# Altium schematic sheet System Control - FPGA Supply and Configuration.SchDoc
size C
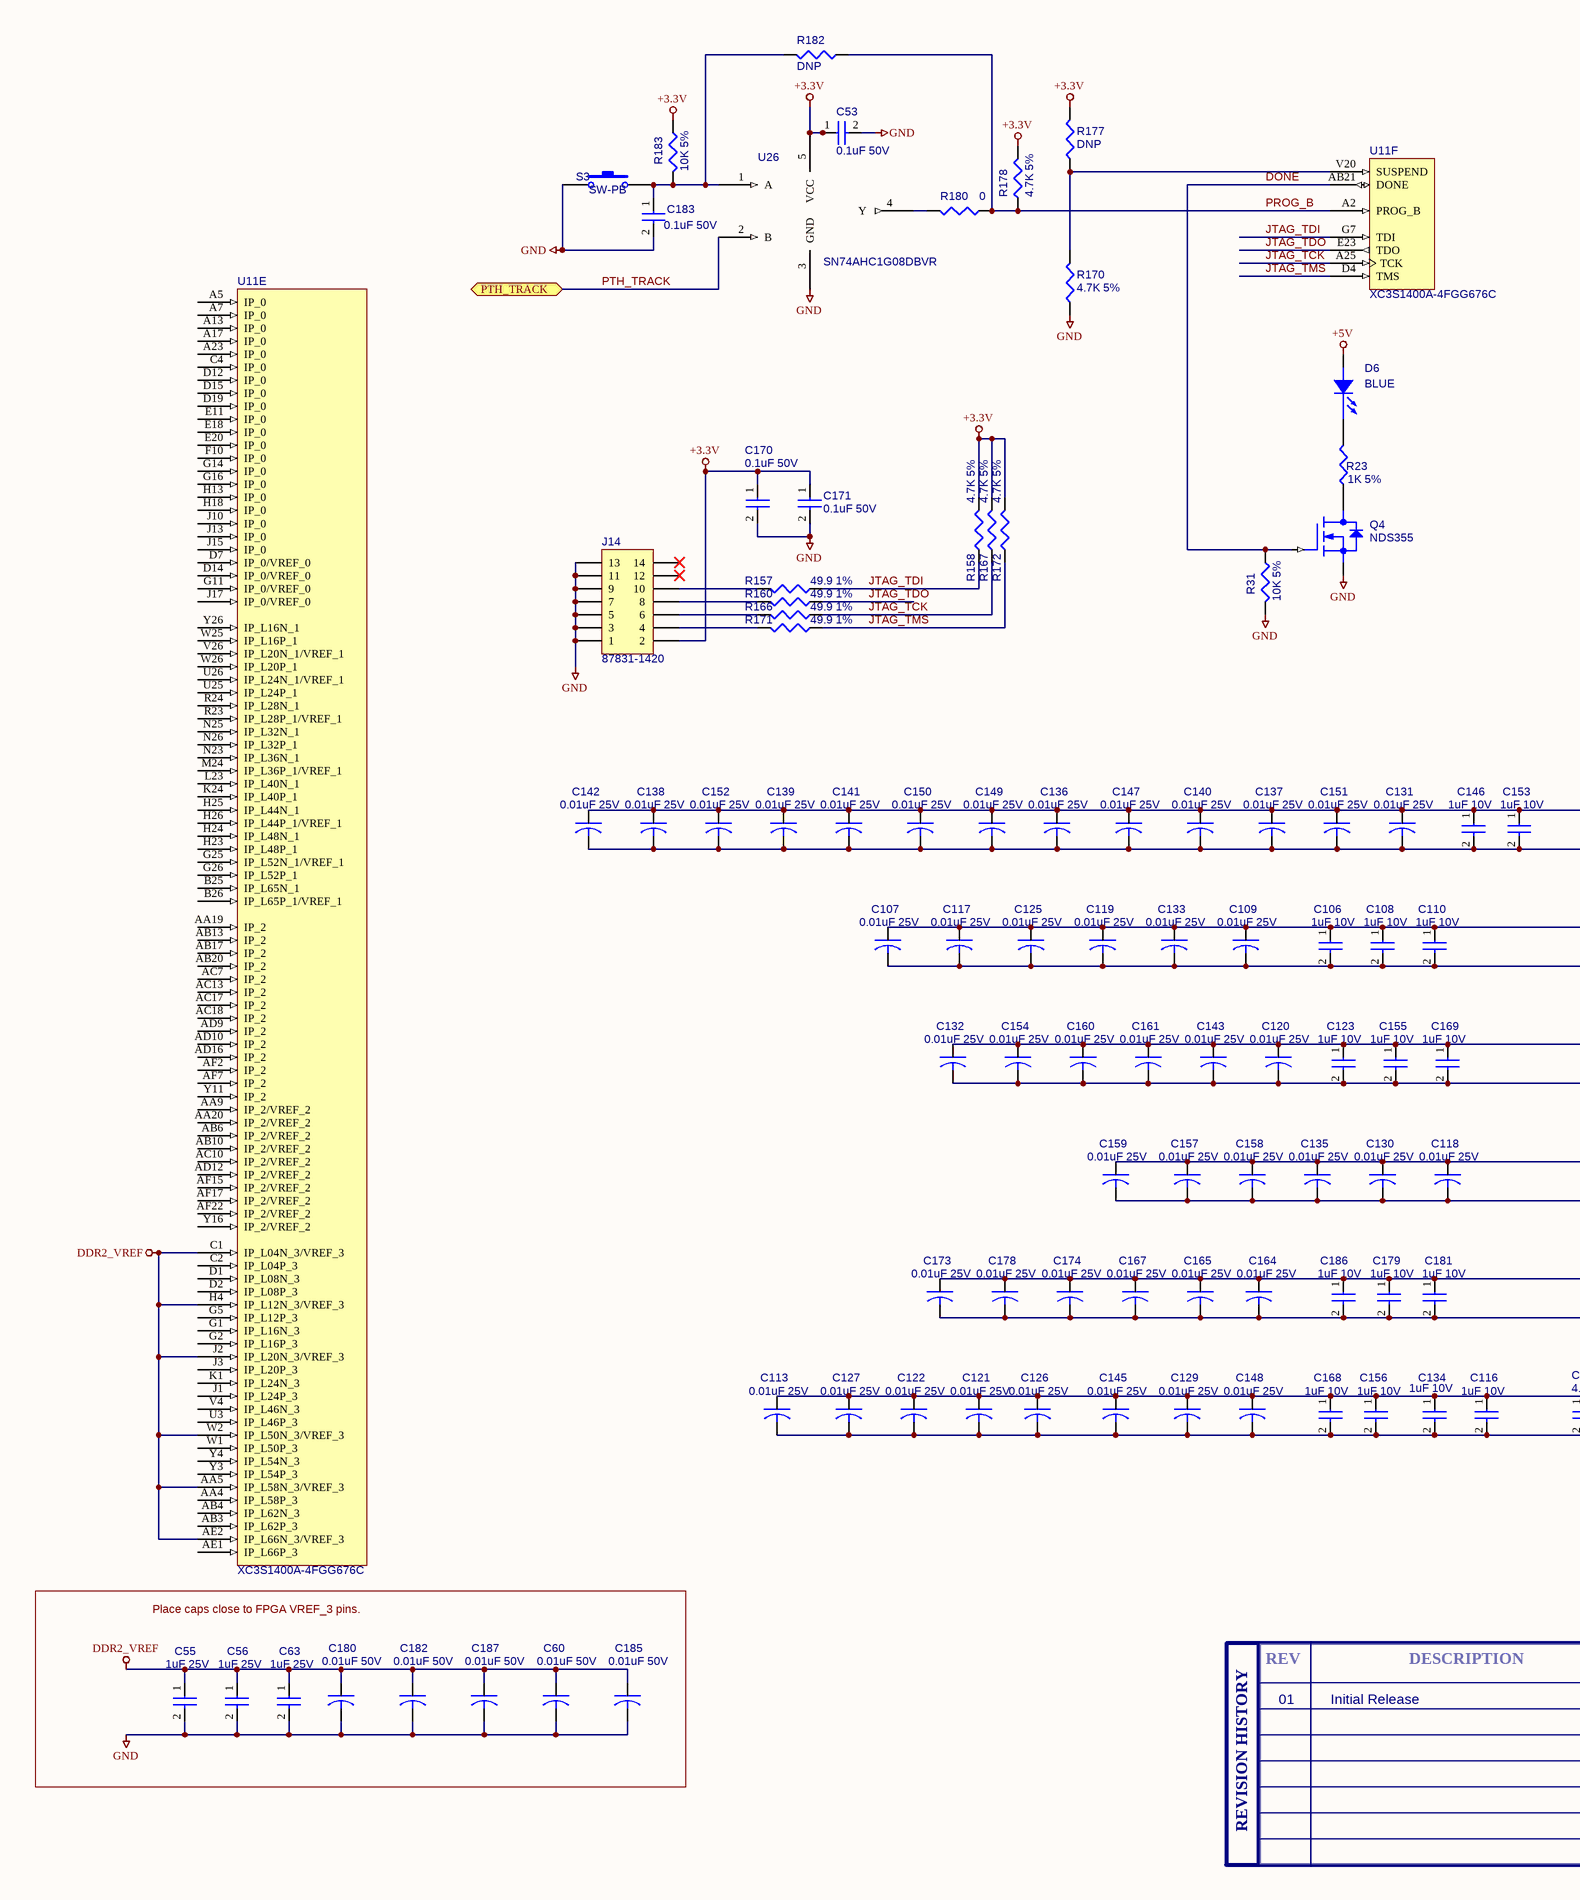
[diagram p0: System Control - FPGA Supply and Configuration.SchDoc, left]
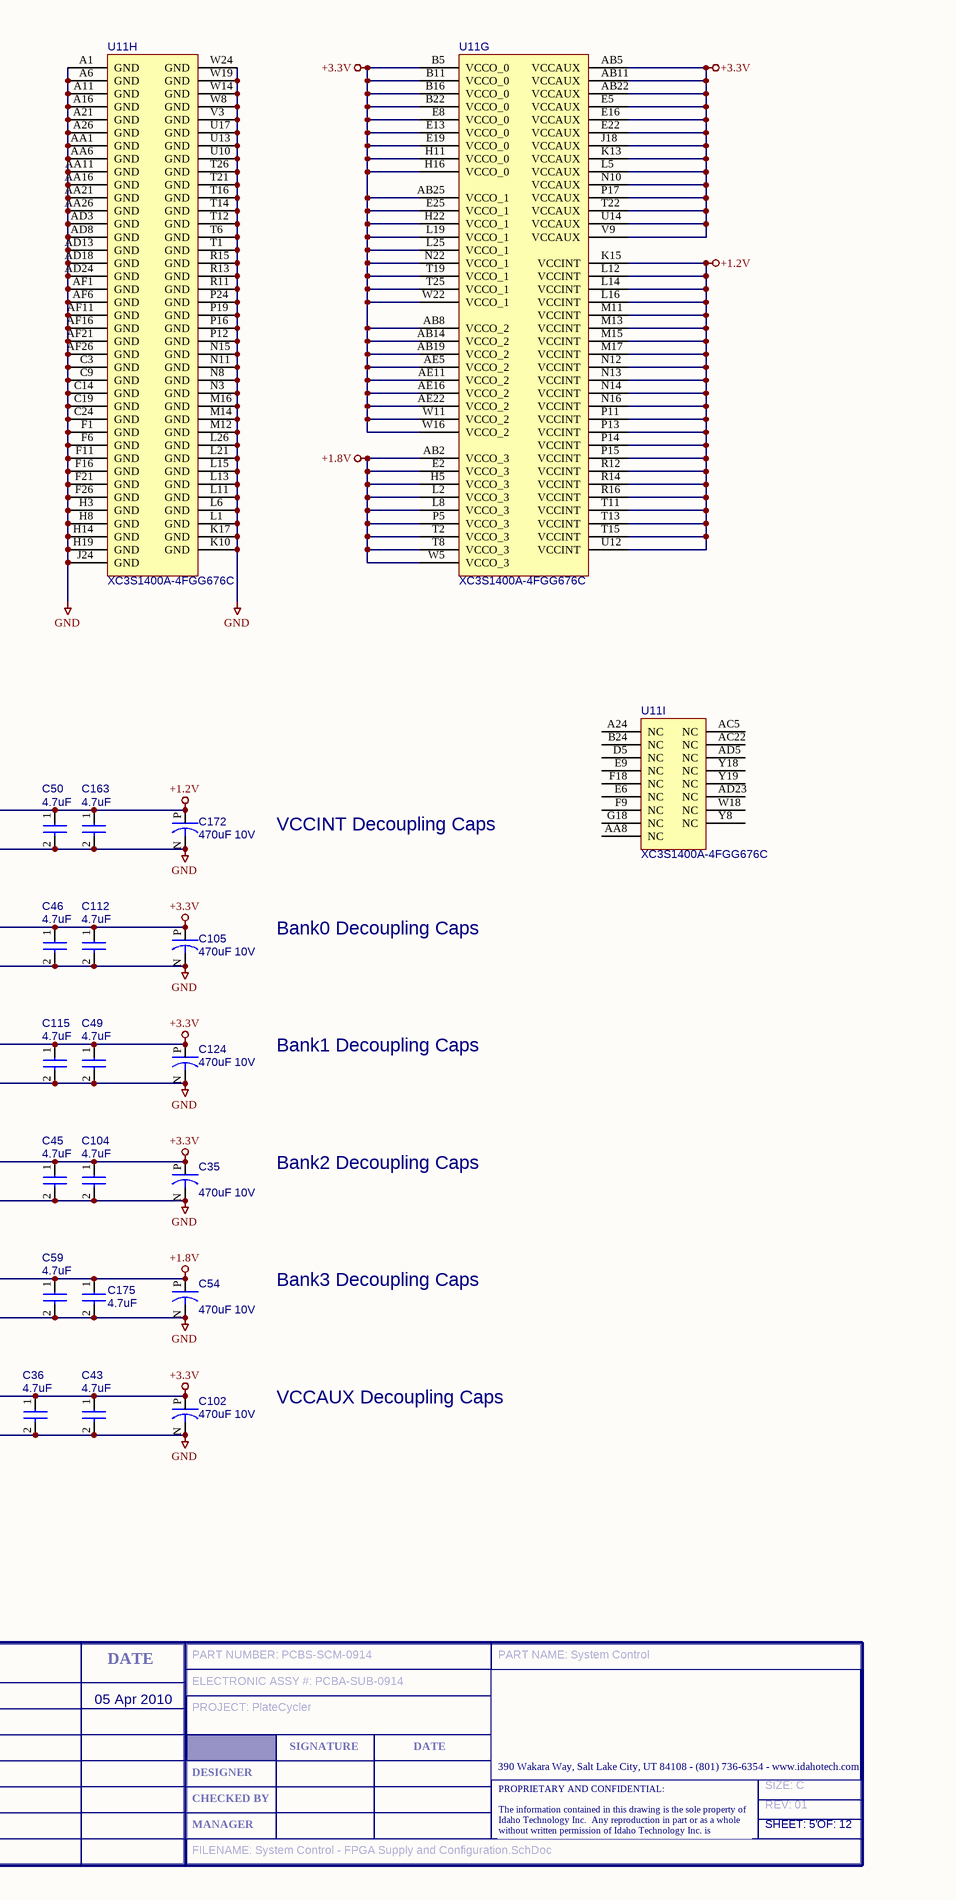
[diagram p1: System Control - FPGA Supply and Configuration.SchDoc, right]

## Parts
C35  470uF 10V  [SM/CT_7360]
C36  4.7uF  [SM/C_0603]
C43  4.7uF  [SM/C_0603]
C45  4.7uF  [SM/C_0603]
C46  4.7uF  [SM/C_0603]
C49  4.7uF  [SM/C_0603]
C50  4.7uF  [SM/C_0603]
C53  0.1uF 50V  [SM/C_0603]
C54  470uF 10V  [SM/CT_7360]
C55  1uF 25V  [SM/C_0603]
C56  1uF 25V  [SM/C_0603]
C59  4.7uF  [SM/C_0603]
C60  0.01uF 50V  [SM/C_0603]
C63  1uF 25V  [SM/C_0603]
C102  470uF 10V  [SM/CT_7360]
C104  4.7uF  [SM/C_0603]
C105  470uF 10V  [SM/CT_7360]
C106  1uF 10V  [SM/C_0603]
C107  0.01uF 25V  [SM/C_0402]
C108  1uF 10V  [SM/C_0603]
C109  0.01uF 25V  [SM/C_0402]
C110  1uF 10V  [SM/C_0603]
C112  4.7uF  [SM/C_0603]
C113  0.01uF 25V  [SM/C_0402]
C115  4.7uF  [SM/C_0603]
C116  1uF 10V  [SM/C_0603]
C117  0.01uF 25V  [SM/C_0402]
C118  0.01uF 25V  [SM/C_0402]
C119  0.01uF 25V  [SM/C_0402]
C120  0.01uF 25V  [SM/C_0402]
C121  0.01uF 25V  [SM/C_0402]
C122  0.01uF 25V  [SM/C_0402]
C123  1uF 10V  [SM/C_0603]
C124  470uF 10V  [SM/CT_7360]
C125  0.01uF 25V  [SM/C_0402]
C126  0.01uF 25V  [SM/C_0402]
C127  0.01uF 25V  [SM/C_0402]
C129  0.01uF 25V  [SM/C_0402]
C130  0.01uF 25V  [SM/C_0402]
C131  0.01uF 25V  [SM/C_0402]
C132  0.01uF 25V  [SM/C_0402]
C133  0.01uF 25V  [SM/C_0402]
C134  1uF 10V  [SM/C_0603]
C135  0.01uF 25V  [SM/C_0402]
C136  0.01uF 25V  [SM/C_0402]
C137  0.01uF 25V  [SM/C_0402]
C138  0.01uF 25V  [SM/C_0402]
C139  0.01uF 25V  [SM/C_0402]
C140  0.01uF 25V  [SM/C_0402]
C141  0.01uF 25V  [SM/C_0402]
C142  0.01uF 25V  [SM/C_0402]
C143  0.01uF 25V  [SM/C_0402]
C145  0.01uF 25V  [SM/C_0402]
C146  1uF 10V  [SM/C_0603]
C147  0.01uF 25V  [SM/C_0402]
C148  0.01uF 25V  [SM/C_0402]
C149  0.01uF 25V  [SM/C_0402]
C150  0.01uF 25V  [SM/C_0402]
C151  0.01uF 25V  [SM/C_0402]
C152  0.01uF 25V  [SM/C_0402]
C153  1uF 10V  [SM/C_0603]
C154  0.01uF 25V  [SM/C_0402]
C155  1uF 10V  [SM/C_0603]
C156  1uF 10V  [SM/C_0603]
C157  0.01uF 25V  [SM/C_0402]
C158  0.01uF 25V  [SM/C_0402]
C159  0.01uF 25V  [SM/C_0402]
C160  0.01uF 25V  [SM/C_0402]
C161  0.01uF 25V  [SM/C_0402]
C163  4.7uF  [SM/C_0603]
C164  0.01uF 25V  [SM/C_0402]
C165  0.01uF 25V  [SM/C_0402]
C167  0.01uF 25V  [SM/C_0402]
C168  1uF 10V  [SM/C_0603]
C169  1uF 10V  [SM/C_0603]
C170  0.1uF 50V  [SM/C_0603]
C171  0.1uF 50V  [SM/C_0603]
C172  470uF 10V  [SM/CT_7360]
C173  0.01uF 25V  [SM/C_0402]
C174  0.01uF 25V  [SM/C_0402]
C175  4.7uF  [SM/C_0603]
C178  0.01uF 25V  [SM/C_0402]
C179  1uF 10V  [SM/C_0603]
C180  0.01uF 50V  [SM/C_0603]
C181  1uF 10V  [SM/C_0603]
C182  0.01uF 50V  [SM/C_0603]
C183  0.1uF 50V  [SM/C_0603]
C185  0.01uF 50V  [SM/C_0603]
C186  1uF 10V  [SM/C_0603]
C187  0.01uF 50V  [SM/C_0603]
D6  BLUE  [LED 1206]
J14  Header 7X2  [87831-1420]  (value not drawn)
Q4  NDS355  [TO236AA/SOT23]
R23  1K 5%  [SM/R_0603]
R31  10K 5%  [SM/R_0603]
R157  49.9 1%  [SM/R_0603]
R158  4.7K 5%  [SM/R_0603]
R160  49.9 1%  [SM/R_0603]
R166  49.9 1%  [SM/R_0603]
R167  4.7K 5%  [SM/R_0603]
R170  4.7K 5%  [SM/R_0603]
R171  49.9 1%  [SM/R_0603]
R172  4.7K 5%  [SM/R_0603]
R177  DNP  [SM/R_0603]  (no BOM)
R178  4.7K 5%  [SM/R_0603]
R180  0  [SM/R_0603]
R182  DNP  [SM/R_0603]  (no BOM)
R183  10K 5%  [SM/R_0603]
S3  SW-PB  [PBSW SMD]
T?  SIZE: C  REV: 01  FILENAME: System Control - FPGA Supply and Configuration.SchDoc  PART NUMBER: PCBS-SCM-0914  PART NAME: System Control  ELECTRONIC ASSY #: PCBA-SUB-0914  PROJECT: PlateCycler  SHEET: 5'  OF: 12  (hidden comment: ITI Title Block, A Size)  (graphical)
U11  XC3S1400A-4FGG676C  [FGG676]  (parts E,F,G,H,I of 9)
U26  Manufacturer P/N: SN74AHC1G08DBVR  [SOT23-5]  (hidden comment: SN74AHC1G08)

## Blocks framed on the sheet
Place caps close to FPGA VREF_3 pins.: C55 C56 C60 C63 C180 C182 C185 C187

## Ports
PTH_TRACK

## Nets
+1.2V: C50.1 C131.1 C136.1 C137.1 C138.1 C139.1 C140.1 C141.1 C142.1 C146.1 C147.1 C149.1 C150.1 C151.1 C152.1 C153.1 C163.1 C172.P U11.K15(VCCINT) U11.L12(VCCINT) U11.L14(VCCINT) U11.L16(VCCINT) U11.M11(VCCINT) U11.M13(VCCINT) U11.M15(VCCINT) U11.M17(VCCINT) U11.N12(VCCINT) U11.N13(VCCINT) U11.N14(VCCINT) U11.N16(VCCINT) U11.P11(VCCINT) U11.P13(VCCINT) U11.P14(VCCINT) U11.P15(VCCINT) U11.R12(VCCINT) U11.R14(VCCINT) U11.R16(VCCINT) U11.T11(VCCINT) U11.T13(VCCINT) U11.T15(VCCINT) U11.U12(VCCINT)
+1.8V: C54.P C59.1 C164.1 C165.1 C167.1 C173.1 C174.1 C175.1 C178.1 C179.1 C181.1 C186.1 U11.AB2(VCCO_3) U11.E2(VCCO_3) U11.H5(VCCO_3) U11.L2(VCCO_3) U11.L8(VCCO_3) U11.P5(VCCO_3) U11.T2(VCCO_3) U11.T8(VCCO_3) U11.W5(VCCO_3)
+3.3V: C35.P C36.1 C43.1 C45.1 C46.1 C49.1 C53.1 C102.P C104.1 C105.P C106.1 C107.1 C108.1 C109.1 C110.1 C112.1 C113.1 C115.1 C116.1 C117.1 C118.1 C119.1 C120.1 C121.1 C122.1 C123.1 C124.P C125.1 C126.1 C127.1 C129.1 C130.1 C132.1 C133.1 C134.1 C135.1 C143.1 C145.1 C148.1 C154.1 C155.1 C156.1 C157.1 C158.1 C159.1 C160.1 C161.1 C168.1 C169.1 C170.1 C171.1 J14.2 R158.2 R167.2 R172.2 R177.2 R178.2 R183.1 U11.AB5(VCCAUX) U11.AB8(VCCO_2) U11.AB11(VCCAUX) U11.AB14(VCCO_2) U11.AB19(VCCO_2) U11.AB22(VCCAUX) U11.AB25(VCCO_1) U11.AE5(VCCO_2) U11.AE11(VCCO_2) U11.AE16(VCCO_2) U11.AE22(VCCO_2) U11.B5(VCCO_0) U11.B11(VCCO_0) U11.B16(VCCO_0) U11.B22(VCCO_0) U11.E5(VCCAUX) U11.E8(VCCO_0) U11.E13(VCCO_0) U11.E16(VCCAUX) U11.E19(VCCO_0) U11.E22(VCCAUX) U11.E25(VCCO_1) U11.H11(VCCO_0) U11.H16(VCCO_0) U11.H22(VCCO_1) U11.J18(VCCAUX) U11.K13(VCCAUX) U11.L5(VCCAUX) U11.L19(VCCO_1) U11.L25(VCCO_1) U11.N10(VCCAUX) U11.N22(VCCO_1) U11.P17(VCCAUX) U11.T19(VCCO_1) U11.T22(VCCAUX) U11.T25(VCCO_1) U11.U14(VCCAUX) U11.V9(VCCAUX) U11.W11(VCCO_2) U11.W16(VCCO_2) U11.W22(VCCO_1) U26.5(VCC)
+5V: D6.1(ANODE)
DDR2_VREF: C55.1 C56.1 C60.1 C63.1 C180.1 C182.1 C185.1 C187.1 U11.AA5(IP_L58N_3/VREF_3) U11.AE2(IP_L66N_3/VREF_3) U11.C1(IP_L04N_3/VREF_3) U11.H4(IP_L12N_3/VREF_3) U11.J2(IP_L20N_3/VREF_3) U11.W2(IP_L50N_3/VREF_3)
GND: C35.N C36.2 C43.2 C45.2 C46.2 C49.2 C50.2 C53.2 C54.N C55.2 C56.2 C59.2 C60.2 C63.2 C102.N C104.2 C105.N C106.2 C107.2 C108.2 C109.2 C110.2 C112.2 C113.2 C115.2 C116.2 C117.2 C118.2 C119.2 C120.2 C121.2 C122.2 C123.2 C124.N C125.2 C126.2 C127.2 C129.2 C130.2 C131.2 C132.2 C133.2 C134.2 C135.2 C136.2 C137.2 C138.2 C139.2 C140.2 C141.2 C142.2 C143.2 C145.2 C146.2 C147.2 C148.2 C149.2 C150.2 C151.2 C152.2 C153.2 C154.2 C155.2 C156.2 C157.2 C158.2 C159.2 C160.2 C161.2 C163.2 C164.2 C165.2 C167.2 C168.2 C169.2 C170.2 C171.2 C172.N C173.2 C174.2 C175.2 C178.2 C179.2 C180.2 C181.2 C182.2 C183.2 C185.2 C186.2 C187.2 J14.1 J14.3 J14.5 J14.7 J14.9 J14.11 J14.13 Q4.2(SOURCE) R31.2 R170.1 S3.1 U11.A1(GND) U11.A6(GND) U11.A11(GND) U11.A16(GND) U11.A21(GND) U11.A26(GND) U11.AA1(GND) U11.AA6(GND) U11.AA11(GND) U11.AA16(GND) U11.AA21(GND) U11.AA26(GND) U11.AD3(GND) U11.AD8(GND) U11.AD13(GND) U11.AD18(GND) U11.AD24(GND) U11.AF1(GND) U11.AF6(GND) U11.AF11(GND) U11.AF16(GND) U11.AF21(GND) U11.AF26(GND) U11.C3(GND) U11.C9(GND) U11.C14(GND) U11.C19(GND) U11.C24(GND) U11.F1(GND) U11.F6(GND) U11.F11(GND) U11.F16(GND) U11.F21(GND) U11.F26(GND) U11.H3(GND) U11.H8(GND) U11.H14(GND) U11.H19(GND) U11.J24(GND) U11.K10(GND) U11.K17(GND) U11.L1(GND) U11.L6(GND) U11.L11(GND) U11.L13(GND) U11.L15(GND) U11.L21(GND) U11.L26(GND) U11.M12(GND) U11.M14(GND) U11.M16(GND) U11.N3(GND) U11.N8(GND) U11.N11(GND) U11.N15(GND) U11.P12(GND) U11.P16(GND) U11.P19(GND) U11.P24(GND) U11.R11(GND) U11.R13(GND) U11.R15(GND) U11.T1(GND) U11.T6(GND) U11.T12(GND) U11.T14(GND) U11.T16(GND) U11.T21(GND) U11.T26(GND) U11.U10(GND) U11.U13(GND) U11.U17(GND) U11.V3(GND) U11.W8(GND) U11.W14(GND) U11.W19(GND) U11.W24(GND) U26.3(GND)
DONE: Q4.1(GATE) R31.1 U11.AB21(DONE)
JTAG_TCK: R166.1 R167.1 U11.A25(TCK)
JTAG_TDI: R157.1 R158.1 U11.G7(TDI)
JTAG_TDO: R160.1 U11.E23(TDO)
JTAG_TMS: R171.1 R172.1 U11.D4(TMS)
PROG_B: R178.1 R180.1 R182.1 U11.A2(PROG_B)
PTH_TRACK: U26.2(B) ; port PTH_TRACK
NetC183_1: C183.1 R182.2 R183.2 S3.2 U26.1(A)
NetD6_2: D6.2(CATHODE) R23.2
NetJ14_4: J14.4 R171.2
NetJ14_6: J14.6 R166.2
NetJ14_8: J14.8 R160.2
NetJ14_10: J14.10 R157.2
NetQ4_3: Q4.3(DRAIN) R23.1
NetR170_2: R170.2 R177.1 U11.V20(SUSPEND)
NetR180_2: R180.2 U26.4(Y)

Not connected (* = marked no-connect by the designer): J14 12* 14*; U11 A5(IP_0) A7(IP_0) A13(IP_0) A17(IP_0) A23(IP_0) A24(NC) AA4(IP_L58P_3) AA8(NC) AA9(IP_2/VREF_2) AA19(IP_2) AA20(IP_2/VREF_2) AB3(IP_L62P_3) AB4(IP_L62N_3) AB6(IP_2/VREF_2) AB10(IP_2/VREF_2) AB13(IP_2) AB17(IP_2) AB20(IP_2) AC5(NC) AC7(IP_2) AC10(IP_2/VREF_2) AC13(IP_2) AC17(IP_2) AC18(IP_2) AC22(NC) AD5(NC) AD9(IP_2) AD10(IP_2) AD12(IP_2/VREF_2) AD16(IP_2) AD23(NC) AE1(IP_L66P_3) AF2(IP_2) AF7(IP_2) AF15(IP_2/VREF_2) AF17(IP_2/VREF_2) AF22(IP_2/VREF_2) B24(NC) B25(IP_L65N_1) B26(IP_L65P_1/VREF_1) C2(IP_L04P_3) C4(IP_0) D1(IP_L08N_3) D2(IP_L08P_3) D5(NC) D7(IP_0/VREF_0) D12(IP_0) D14(IP_0/VREF_0) D15(IP_0) D19(IP_0) E6(NC) E9(NC) E11(IP_0) E18(IP_0) E20(IP_0) F9(NC) F10(IP_0) F18(NC) G1(IP_L16N_3) G2(IP_L16P_3) G5(IP_L12P_3) G11(IP_0/VREF_0) G14(IP_0) G16(IP_0) G18(NC) G25(IP_L52N_1/VREF_1) G26(IP_L52P_1) H13(IP_0) H18(IP_0) H23(IP_L48P_1) H24(IP_L48N_1) H25(IP_L44N_1) H26(IP_L44P_1/VREF_1) J1(IP_L24P_3) J3(IP_L20P_3) J10(IP_0) J13(IP_0) J15(IP_0) J17(IP_0/VREF_0) K1(IP_L24N_3) K24(IP_L40P_1) L23(IP_L40N_1) M24(IP_L36P_1/VREF_1) N23(IP_L36N_1) N25(IP_L32N_1) N26(IP_L32P_1) R23(IP_L28P_1/VREF_1) R24(IP_L28N_1) U3(IP_L46P_3) U25(IP_L24P_1) U26(IP_L24N_1/VREF_1) V4(IP_L46N_3) V26(IP_L20N_1/VREF_1) W1(IP_L50P_3) W18(NC) W25(IP_L16P_1) W26(IP_L20P_1) Y3(IP_L54P_3) Y4(IP_L54N_3) Y8(NC) Y11(IP_2) Y16(IP_2/VREF_2) Y18(NC) Y19(NC) Y26(IP_L16N_1)

## Notes on the sheet
- VCCINT Decoupling Caps
- Bank0 Decoupling Caps
- Bank1 Decoupling Caps
- Bank2 Decoupling Caps
- Bank3 Decoupling Caps
- VCCAUX Decoupling Caps
- 01
- Initial Release
- 05 Apr 2010
- (in symbol ITI A-size Title Block and Rev Table) REV; DESCRIPTION; DATE; SIGNATURE; 390 Wakara Way, Salt Lake City, UT 84108 - (801) 736-6354 - www.idahotech.com; DESIGNER; CHECKED BY; REVISION HISTORY; MANAGER; PROPRIETARY AND CONFIDENTIAL: / The information contained in this drawing is the sole property of / Idaho Technology Inc.  Any reproduction in part or as a whole / without written permission of Idaho Technology Inc. is prohibited.

## Library data of the parts
C35 C54 C102 C105 C124 C172 = CAP_1: CAP TANT LOESR 470UF 10V 10% SMD; Manufacturer: AVX Corporation; Manufacturer P/N: TPSV477K010R0060; Vendor: Digikey; Vendor P/N: 478-4162-1-ND
C36 C43 C45 C46 C49 C50 C59 C104 C112 C115 C163 C175 = CAP NP_1: CAP CER 4.7UF 10V Y5V 0603; Manufacturer P/N: GRM188F51A475ZE20D; Manufacturer: Murata; Vendor P/N: 490-3302-1-ND; Vendor: Digikey
C53 C170 C171 C183 = CAP NP_1: CAP CER .10UF 50V X7R 0603; Manufacturer P/N: UMK107B7104KA-T; Manufacturer: Taiyo Yuden; Vendor P/N: 587-1243-1-ND; Vendor: Digikey
C55 C56 C63 = CAP NP_1: CAP 1UF 25V CERAMIC 0603 X5S; Manufacturer P/N: ECJ-1V41E105M; Manufacturer: Panasonic; Vendor P/N: PCC2354CT-ND; Vendor: Digikey
C60 C180 C182 C185 C187 = C10nF 50V X7R 0603: CAP 10000PF 50V CERM X7R 0603; Manufacturer: Panasonic; Manufacturer P/N: ECJ-1VB1H103K; Vendor P/N: PCC1784CT-ND; Vendor: Digikey
C106 C108 C110 C116 C123 C134 C146 C153 C155 C156 C168 C169 C179 C181 C186 = CAP NP_1: CAP CER 1.0UF 10V X5R 10% 0402; Manufacturer P/N: 0402ZD105KAT2A; Manufacturer: AVX Corporation; Vendor P/N: 478-4596-1-ND; Vendor: Digikey
C107 C109 C113 C117-C122 C125-C127 C129-C133 C135-C143 C145 C147-C152 C154 C157-C161 C164 C165 C167 C173 C174 C178 = C10nF 50V X7R 0603: CAP .01UF 25V CERAMIC X7R 0402; Manufacturer: Panasonic; Manufacturer P/N: ECJ-0EB1E103K; Vendor P/N: PCC2270CT-ND; Vendor: Digikey
D6 = LED: LED INGAN/SIC U-BLUE CLR 1206SMD; Manufacturer: Lumex; Manufacturer P/N: SML-LX1206USBC-TR; Vendor: Digikey; Vendor P/N: 67-1701-1-ND
J14 = Header 7X2: CONN HEADER 14POS 2MM VERT GOLD; Manufacturer: Molex; Vendor P/N: WM17469-ND; Vendor: Digikey; LatestRevisionDate: 17-Jul-2002; LatestRevisionNote: Re-released for DXP Platform.; Publisher: Altium Limited; Manufacturer P/N: 87831-1420
Q4 = NDS355N/SOT: MOSFET N-CH 30V 1.6A SOT-23; Manufacturer: Fairchild Semiconductor; Vendor: Digikey; Vendor P/N: NDS355NCT-ND; Manufacturer P/N: NDS355N
R23 = R1K 5% 0603: RES 1.0K OHM 1/10W 5% 0603 SMD; Manufacturer: Panasonic; Manufacturer P/N: ERJ-3GEYJ102V; Vendor: Digikey; Vendor P/N: P1.0KGCT-ND
R31 R183 = R10K 5% 0603: RES 10K OHM 1/10W 5% 0603 SMD; Manufacturer: Panasonic; Manufacturer P/N: ERJ-3GEYJ103V; Vendor: Digikey; Vendor P/N: P10KGCT-ND
R157 R160 R166 R171 = R1K 5% 0603: RES 49.9 OHM 1/10W 1% 0603 SMD; Manufacturer: Panasonic; Manufacturer P/N: ERJ-3EKF49R9V; Vendor: Digikey; Vendor P/N: P49.9HCT-ND
R158 R167 R170 R172 R177 R178 = R4.7K 5% 0603: RES 4.7K OHM 1/10W 5% 0603 SMD; Manufacturer P/N: ERJ-3GEYJ472V; Manufacturer: Panasonic; Vendor: Digikey; Vendor P/N: P4.7KGCT-ND
R180 R182 = R0 5% 0603: RES ZERO OHM 1/10W 5% 0603 SMD; Manufacturer: Panasonic; Manufacturer P/N: ERJ-3GEY0R00V; Vendor: Digikey; Vendor P/N: P0.0GCT-ND
S3 = SW-PB: SWITCH KEY 4MM SQ SMD GULL WING; Manufacturer: Bourns; Manufacturer P/N: 7914G-1-000E; Vendor P/N: 7914G-000ECT-ND; Vendor: Digikey
T? = ITI A-size Title Block and Rev Table: ITI Title Block and Rev Table, A Size
U11 = XC3S1400A-4FGG676C: Spartan-3A  I/O Optimized FPGA, 502 User I/Os, 676-Pin Pb-Free FBGA, Standard Performance, Commercial Grade; Published: 12-Dec-2006; DatasheetVersion: 08-May-2007; PackageVersion: ver1.2.1, Apr-2005; PackageReference: FGG676; Publisher: Altium Limited; PackageDescription: 676-Ball Fine Pitch Ball Grid Array (FGG676) - Pb-Free; Code_JEDEC: MS-034-AAL-1; Code_IPC: BGA100P26X26-676; ComponentLink1Description: Manufacturer Link; ComponentLink1URL: http://www.xilinx.com/products/silicon_solutions/fpgas/spartan_series/spartan3a_fpgas/index.htm; ComponentLink2Description: Datasheet; ComponentLink2URL: http://direct.xilinx.com/bvdocs/publications/ds529.pdf
U26 = SN74AHC1G08: IC SGL 2IN POS-AND GATE SOT23-5; Manufacturer: Texas Instruments; Vendor P/N: 296-1091-1-ND; Vendor: Digikey; LatestRevisionDate: 17-Jul-2002; LatestRevisionNote: Re-released for DXP Platform.; Publisher: Altium Limited